# EAGLE schematic Chassis2Smol (EAGLE 9.6.2)
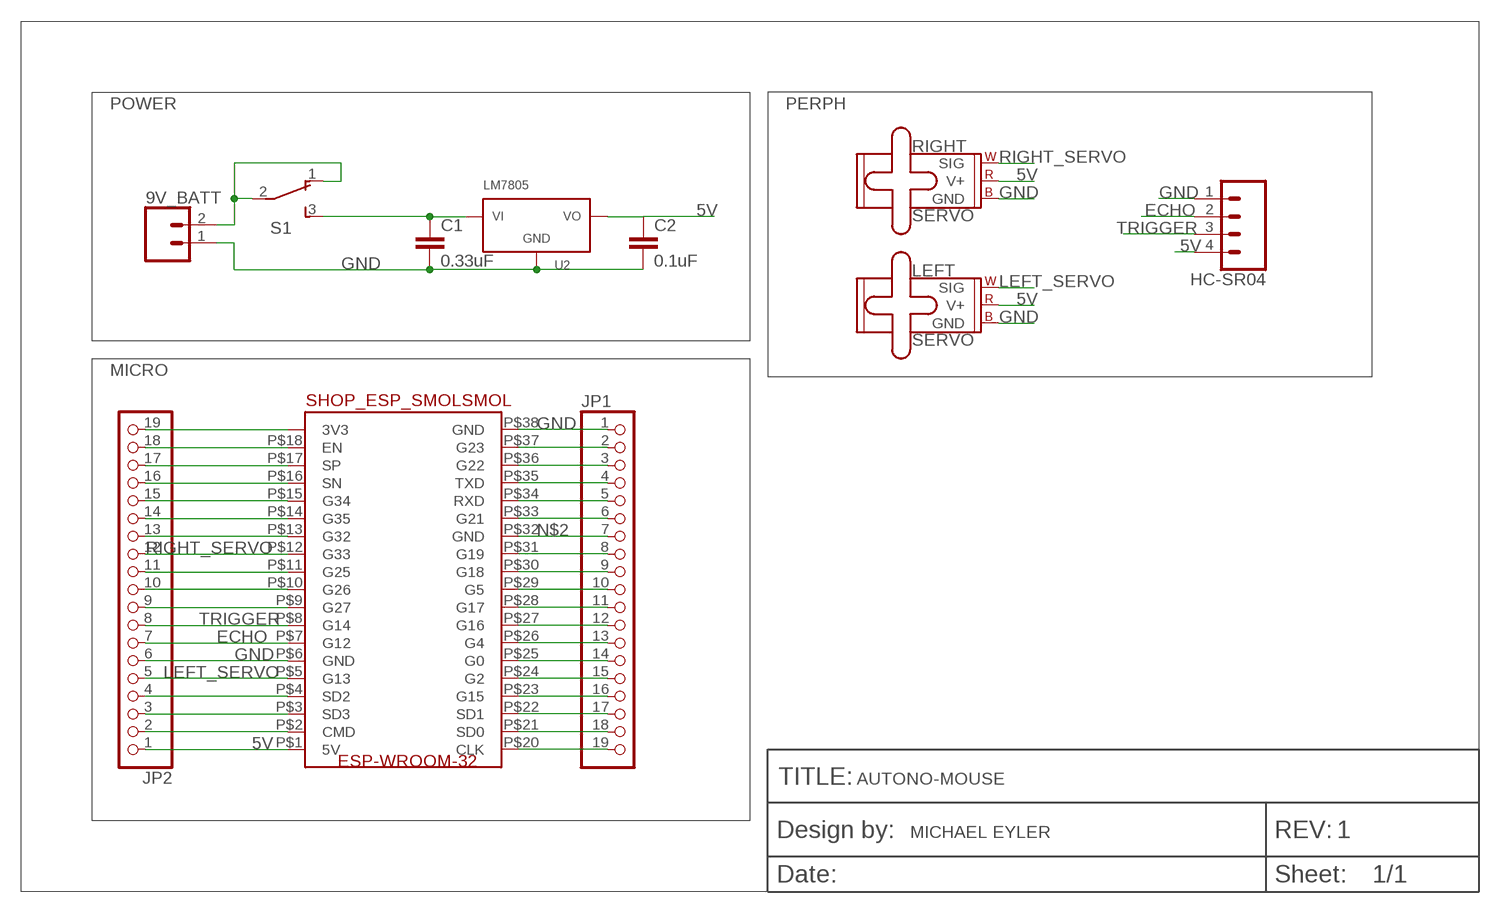
[diagram p0: schematic, sheet 1]

## Parts
9V_BATT  CONN_02  [1X02]
C1  0.33uF  0.1UF-KIT-EZ-50V-20%  [CAP-PTH-SMALL-KIT]
C2  0.1uF  0.1UF-KIT-EZ-50V-20%  [CAP-PTH-SMALL-KIT]
HC-SR04  CONN_04PTH  [1X04]
JP1  PINHD-1X19  [1X19]
JP2  PINHD-1X19  [1X19]
LEFT  SERVO  [1X03]
RIGHT  SERVO  [1X03]
S1  TL36PO  [TL3XPO]
U2  LM7805  [TO220H]
U$1  FRAME-BADGE  [DUMMY]
U$2  SHOP_ESP_SMOLSMOL  [ESP32-WROOM-32_SMOL]

## Nets
5V: C2.1 HC-SR04.4 JP2.1 LEFT.2(V+) RIGHT.2(V+) U2.3(VOUT) U$2.P$1(5V)
ECHO: HC-SR04.2 JP2.7 U$2.P$7(G12)
GND: 9V_BATT.1 C1.2 C2.2 HC-SR04.1 JP1.1 JP2.6 LEFT.3(GND) RIGHT.3(GND) U2.2(GND) U$2.P$6(GND) U$2.P$38(GND)
LEFT_SERVO: JP2.5 LEFT.1(SIG) U$2.P$5(G13)
N$1: 9V_BATT.2 S1.1(O) S1.2(P)
N$2: JP1.7 U$2.P$32(GND)
N$3: JP2.19 U$2.P$19(3V3)
N$4: JP2.18 U$2.P$18(EN)
N$5: JP2.17 U$2.P$17(SP)
N$6: JP2.16 U$2.P$16(SN)
N$7: JP2.15 U$2.P$15(G34)
N$8: JP2.14 U$2.P$14(G35)
N$9: JP2.13 U$2.P$13(G32)
N$10: JP2.11 U$2.P$11(G25)
N$11: JP2.10 U$2.P$10(G26)
N$12: JP2.9 U$2.P$9(G27)
N$13: JP2.4 U$2.P$4(SD2)
N$14: JP2.3 U$2.P$3(SD3)
N$15: JP2.2 U$2.P$2(CMD)
N$16: JP1.19 U$2.P$20(CLK)
N$17: JP1.18 U$2.P$21(SD0)
N$18: JP1.17 U$2.P$22(SD1)
N$19: JP1.2 U$2.P$37(G23)
N$20: JP1.3 U$2.P$36(G22)
N$21: JP1.4 U$2.P$35(TXD)
N$22: JP1.5 U$2.P$34(RXD)
N$23: JP1.6 U$2.P$33(G21)
N$24: JP1.8 U$2.P$31(G19)
N$25: JP1.9 U$2.P$30(G18)
N$26: JP1.10 U$2.P$29(G5)
N$27: JP1.11 U$2.P$28(G17)
N$28: JP1.12 U$2.P$27(G16)
N$29: JP1.13 U$2.P$26(G4)
N$30: JP1.14 U$2.P$25(G0)
N$31: JP1.15 U$2.P$24(G2)
N$32: JP1.16 U$2.P$23(G15)
RIGHT_SERVO: JP2.12 RIGHT.1(SIG) U$2.P$12(G33)
TRIGGER: HC-SR04.3 JP2.8 U$2.P$8(G14)
VIN: C1.1 S1.3(S) U2.1(VIN)

## Notes on the sheet
- POWER | PERPH
- MICRO
- AUTONO-MOUSE
- MICHAEL EYLER | 1

## Library data of the parts
9V_BATT = SparkFun-Connectors:CONN_02: Multi connection point. Often used as Generic Header-pin footprint for 0.1 inch spaced/style header connections On any of the 0.1 inch spaced packages, you can populate with these: Break Away Headers - Straight <https://www.sparkfun.com/products/116> (PRT-00116) Break Away Male Headers - Right Angle <https://www.sparkfun.com/products/553> (PRT-00553) Female Headers <https://www.sparkfun.com/products/115> (PRT-00115) Break Away Headers - Machine Pin <https://www.sparkfun.com/products/117> (PRT-00117) Break Away Female Headers - Swiss Machine Pin <https://www.sparkfun.com/products/743> (PRT-00743) For SCREWTERMINALS and SPRING TERMINALS visit here: Screw Terimnals on SparkFun.com <https://www.sparkfun.com/search/results?term=Screw+Terminals> (5mm/3.5mm/2.54mm spacing) This device is also useful as a general connection point to wire up your design to another part of your project. Our various solder wires solder well into these plated through hole pads. Hook-Up Wire - Assortment (Stranded, 22 AWG) <https://www.sparkfun.com/products/11375> (PRT-11375) Hook-Up Wire - Assortment (Solid Core, 22 AWG) <https://www.sparkfun.com/products/11367> (PRT-11367) View the entire wire category on our website here <https://www.sparkfun.com/categories/141> Special notes: Molex polarized connector foot print use with: PRT-08233 with associated crimp pins and housings. 2.54_SCREWTERM for use with PRT-10571. 3.5mm Screw Terminal footprints for PRT-08084 5mm Screw Terminal footprints for use with PRT-08432
C1 = SparkFun-Capacitors:0.1UF: 0.1µF ceramic capacitors A capacitor is a passive two-terminal electrical component used to store electrical energy temporarily in an electric field.; PROD_ID: CAP-08370; VALUE: 0.1uF
C2 = SparkFun-Capacitors:0.1UF: 0.1µF ceramic capacitors A capacitor is a passive two-terminal electrical component used to store electrical energy temporarily in an electric field.; PROD_ID: CAP-08370
HC-SR04 = SparkFun-Connectors:CONN_04: Multi connection point. Often used as Generic Header-pin footprint for 0.1 inch spaced/style header connections On any of the 0.1 inch spaced packages, you can populate with these: Break Away Headers - Straight <https://www.sparkfun.com/products/116> (PRT-00116) Break Away Male Headers - Right Angle <https://www.sparkfun.com/products/553> (PRT-00553) Female Headers <https://www.sparkfun.com/products/115> (PRT-00115) Break Away Headers - Machine Pin <https://www.sparkfun.com/products/117> (PRT-00117) Break Away Female Headers - Swiss Machine Pin <https://www.sparkfun.com/products/743> (PRT-00743) For SCREWTERMINALS and SPRING TERMINALS visit here: Screw Terimnals on SparkFun.com <https://www.sparkfun.com/search/results?term=Screw+Terminals> (5mm/3.5mm/2.54mm spacing) This device is also useful as a general connection point to wire up your design to another part of your project. Our various solder wires solder well into these plated through hole pads. Hook-Up Wire - Assortment (Stranded, 22 AWG) <https://www.sparkfun.com/products/11375> (PRT-11375) Hook-Up Wire - Assortment (Solid Core, 22 AWG) <https://www.sparkfun.com/products/11367> (PRT-11367) View the entire wire category on our website here <https://www.sparkfun.com/categories/141> Special notes: Molex polarized connector foot print use with SKU : PRT-08231 with associated crimp pins and housings. 1MM SMD Version SKU: PRT-10208; PROD_ID: CONN-09696
JP1 JP2 = pinhead_special:PINHD-1X19: PIN HEADER
LEFT RIGHT = SparkFun-Electromechanical:SERVO: Servo Motor 3-pin connector for a standard servo motor (voltage supply, ground, and control signal.) SparkFun Products Servo - Generic (Sub-Micro Size) <https://www.sparkfun.com/products/9065> (ROB-09065) Servo - Generic High Torque Continuous Rotation (Standard Size) <https://www.sparkfun.com/products/9347> (ROB-09347) Servo - Generic High Torque (Standard Size) <https://www.sparkfun.com/products/11965> (ROB-11965)
S1 = switch:TL36PO: TINY SWITCH ON - ON Source: http://www2.produktinfo.conrad.com/datenblaetter/700000-724999/705152-da-01-de-Subminiaturschalter_TL_36YO.pdf
U2 = class-parts:LM7805
U$1 = AndysLib:FRAME-BADGE
U$2 = AAALib:SHOP_ESP_SMOL